# EAGLE schematic VLR_ENCoMAT (EAGLE 7.2.0)

## Sheet 1 of 2
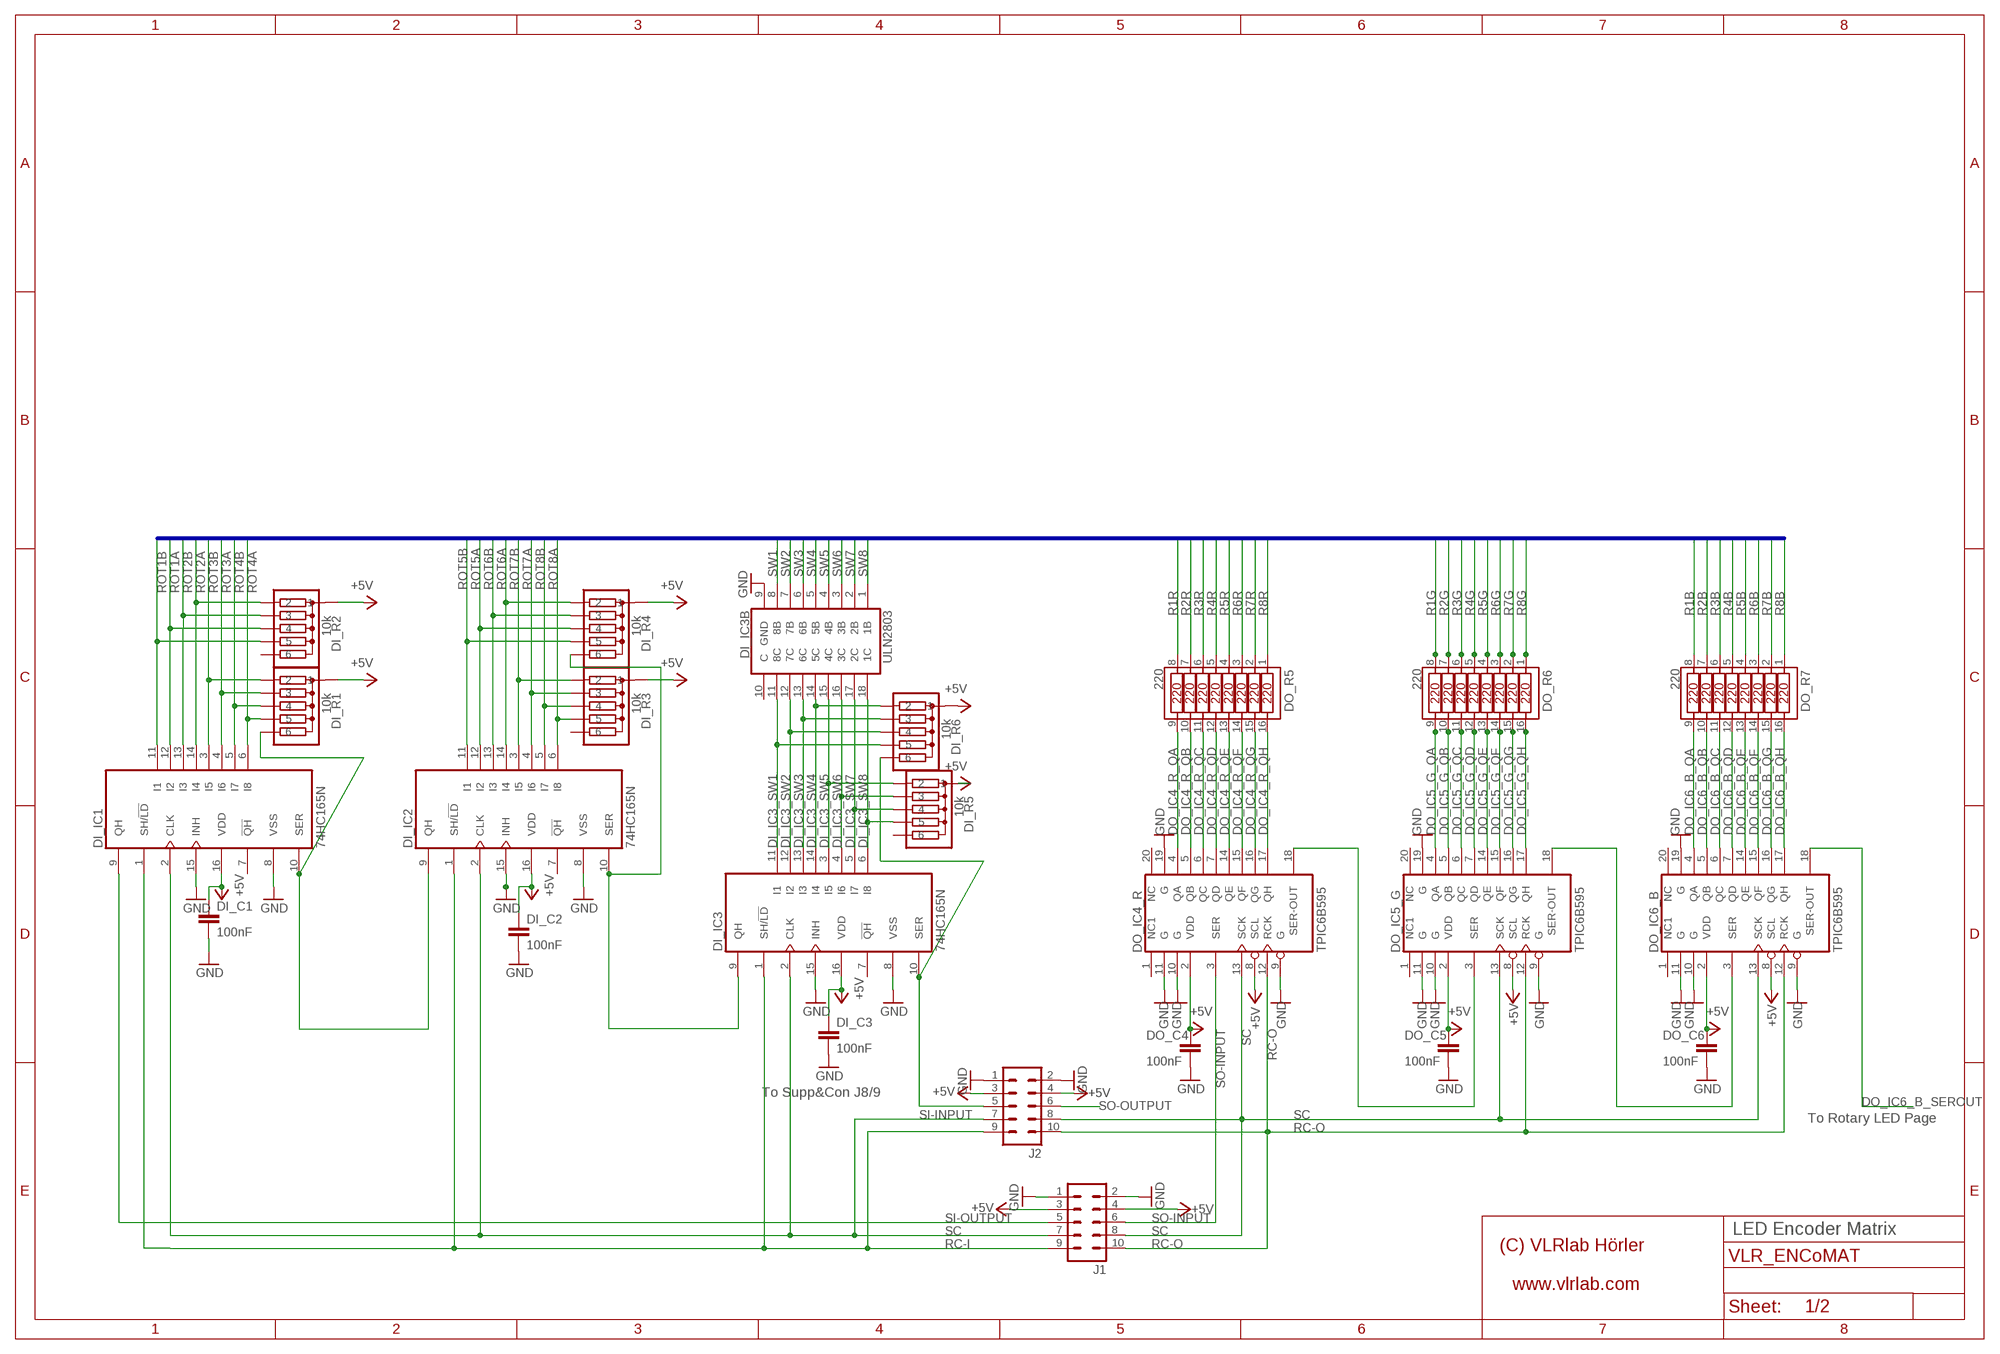
[diagram p0: schematic, sheet 1]

### Parts
DI_C1  100nF  C-EU025-024X044  [C025-024X044]
DI_C2  100nF  C-EU025-024X044  [C025-024X044]
DI_C3  100nF  C-EU025-024X044  [C025-024X044]
DI_IC1  74HC165N  74HC165NSO16D  [SO16D]
DI_IC2  74HC165N  74HC165NSO16D  [SO16D]
DI_IC3  74HC165N  74HC165NSO16D  [SO16D]
DI_IC3B  ULN2803  ULN2803SO18W  [SO18W]
DI_R1  10k  4306R-SMD-R  [SIL6-SMD-R]
DI_R2  10k  4306R-SMD  [SIL6-SMD]
DI_R3  10k  4306R-SMD-R  [SIL6-SMD-R]
DI_R4  10k  4306R-SMD  [SIL6-SMD]
DI_R5  10k  4306R-SMD  [SIL6-SMD]
DI_R6  10k  4306R-SMD-R  [SIL6-SMD-R]
DO_C4  100nF  C-EU025-024X044  [C025-024X044]
DO_C5  100nF  C-EU025-024X044  [C025-024X044]
DO_C6  100nF  C-EU025-024X044  [C025-024X044]
DO_IC4_R  TPIC6B595  TPIC6B595SO20W  [SO20W]
DO_IC5_G  TPIC6B595  TPIC6B595SO20W  [SO20W]
DO_IC6_B  TPIC6B595  TPIC6B595SO20W  [SO20W]
DO_R5  220  4816P-1SOIC16W  [SOIC16W]
DO_R6  220  4816P-1SOIC16W  [SOIC16W]
DO_R7  220  4816P-1SOIC16W  [SOIC16W]
J1  ML10  [ML10]
J2  ML10  [ML10]

### Nets
+5V [VDD]: DI_C1.1 DI_C2.1 DI_C3.1 DI_IC1.16(VDD) DI_IC2.16(VDD) DI_IC3.16(VDD) DI_R1.P$6 DI_R2.P$1 DI_R3.P$6 DI_R4.P$1 DI_R5.P$1 DI_R6.P$6 DO_C4.1 DO_C5.1 DO_C6.1 DO_IC4_R.2(VDD) DO_IC4_R.8(SCL) DO_IC5_G.2(VDD) DO_IC5_G.8(SCL) DO_IC6_B.2(VDD) DO_IC6_B.8(SCL) J1.3 J1.4 J2.3 J2.4 ; also sheet 2
DI_IC3_SW1: DI_IC3.11(I1) DI_IC3B.11(8C) DI_R6.P$2
DI_IC3_SW2: DI_IC3.12(I2) DI_IC3B.12(7C) DI_R6.P$3
DI_IC3_SW3: DI_IC3.13(I3) DI_IC3B.13(6C) DI_R6.P$4
DI_IC3_SW4: DI_IC3.14(I4) DI_IC3B.14(5C) DI_R6.P$5
DI_IC3_SW5: DI_IC3.3(I5) DI_IC3B.15(4C) DI_R5.P$2
DI_IC3_SW6: DI_IC3.4(I6) DI_IC3B.16(3C) DI_R5.P$3
DI_IC3_SW7: DI_IC3.5(I7) DI_IC3B.17(2C) DI_R5.P$4
DI_IC3_SW8: DI_IC3.6(I8) DI_IC3B.18(1C) DI_R5.P$5
DI_IC4_SER_OUT2: DI_IC1.10(SER) DI_IC2.9(QH) DI_R1.P$1
DI_IC5_SER_OUT2: DI_IC2.10(SER) DI_IC3.9(QH) DI_R4.P$6
DO_IC4_R_QA: DO_IC4_R.4(QA) DO_R5.9
DO_IC4_R_QB: DO_IC4_R.5(QB) DO_R5.10
DO_IC4_R_QC: DO_IC4_R.6(QC) DO_R5.11
DO_IC4_R_QD: DO_IC4_R.7(QD) DO_R5.12
DO_IC4_R_QE: DO_IC4_R.14(QE) DO_R5.13
DO_IC4_R_QF: DO_IC4_R.15(QF) DO_R5.14
DO_IC4_R_QG: DO_IC4_R.16(QG) DO_R5.15
DO_IC4_R_QH: DO_IC4_R.17(QH) DO_R5.16
DO_IC4_R_SEROUT: DO_IC4_R.18(SER-OUT) DO_IC5_G.3(SER)
DO_IC5_G_QA: DO_IC5_G.4(QA) DO_R6.9
DO_IC5_G_QB: DO_IC5_G.5(QB) DO_R6.10
DO_IC5_G_QC: DO_IC5_G.6(QC) DO_R6.11
DO_IC5_G_QD: DO_IC5_G.7(QD) DO_R6.12
DO_IC5_G_QE: DO_IC5_G.14(QE) DO_R6.13
DO_IC5_G_QF: DO_IC5_G.15(QF) DO_R6.14
DO_IC5_G_QG: DO_IC5_G.16(QG) DO_R6.15
DO_IC5_G_QH: DO_IC5_G.17(QH) DO_R6.16
DO_IC5_G_SEROUT: DO_IC5_G.18(SER-OUT) DO_IC6_B.3(SER)
DO_IC6_B_QA: DO_IC6_B.4(QA) DO_R7.9
DO_IC6_B_QB: DO_IC6_B.5(QB) DO_R7.10
DO_IC6_B_QC: DO_IC6_B.6(QC) DO_R7.11
DO_IC6_B_QD: DO_IC6_B.7(QD) DO_R7.12
DO_IC6_B_QE: DO_IC6_B.14(QE) DO_R7.13
DO_IC6_B_QF: DO_IC6_B.15(QF) DO_R7.14
DO_IC6_B_QG: DO_IC6_B.16(QG) DO_R7.15
DO_IC6_B_QH: DO_IC6_B.17(QH) DO_R7.16
DO_IC6_B_SEROUT: DO_IC6_B.18(SER-OUT) ; also sheet 2
GND: DI_C1.2 DI_C2.2 DI_C3.2 DI_IC1.8(VSS) DI_IC1.15(INH) DI_IC2.8(VSS) DI_IC2.15(INH) DI_IC3.8(VSS) DI_IC3.15(INH) DI_IC3B.9(GND) DO_C4.2 DO_C5.2 DO_C6.2 DO_IC4_R.9(G) DO_IC4_R.10(G) DO_IC4_R.11(G) DO_IC4_R.19(G) DO_IC5_G.9(G) DO_IC5_G.10(G) DO_IC5_G.11(G) DO_IC5_G.19(G) DO_IC6_B.9(G) DO_IC6_B.10(G) DO_IC6_B.11(G) DO_IC6_B.19(G) J1.1 J1.2 J2.1 J2.2 ; also sheet 2
R1B: DO_R7.8 ; also sheet 2
R1G: DO_R6.8 ; also sheet 2
R1R: DO_R5.8 ; also sheet 2
R2B: DO_R7.7 ; also sheet 2
R2G: DO_R6.7 ; also sheet 2
R2R: DO_R5.7 ; also sheet 2
R3B: DO_R7.6 ; also sheet 2
R3G: DO_R6.6 ; also sheet 2
R3R: DO_R5.6 ; also sheet 2
R4B: DO_R7.5 ; also sheet 2
R4G: DO_R6.5 ; also sheet 2
R4R: DO_R5.5 ; also sheet 2
R5B: DO_R7.4 ; also sheet 2
R5G: DO_R6.4 ; also sheet 2
R5R: DO_R5.4 ; also sheet 2
R6B: DO_R7.3 ; also sheet 2
R6G: DO_R6.3 ; also sheet 2
R6R: DO_R5.3 ; also sheet 2
R7B: DO_R7.2 ; also sheet 2
R7G: DO_R6.2 ; also sheet 2
R7R: DO_R5.2 ; also sheet 2
R8B: DO_R7.1 ; also sheet 2
R8G: DO_R6.1 ; also sheet 2
R8R: DO_R5.1 ; also sheet 2
RC-I: DI_IC1.1(SH/!LD) DI_IC2.1(SH/!LD) DI_IC3.1(SH/!LD) J1.9 J2.9
RC-O: DO_IC4_R.12(RCK) DO_IC5_G.12(RCK) DO_IC6_B.12(RCK) J1.10 J2.10 ; also sheet 2
ROT1A: DI_IC1.12(I2) DI_R2.P$4 ; also sheet 2
ROT1B: DI_IC1.11(I1) DI_R2.P$5 ; also sheet 2
ROT2A: DI_IC1.14(I4) DI_R2.P$2 ; also sheet 2
ROT2B: DI_IC1.13(I3) DI_R2.P$3 ; also sheet 2
ROT3A: DI_IC1.4(I6) DI_R1.P$4 ; also sheet 2
ROT3B: DI_IC1.3(I5) DI_R1.P$5 ; also sheet 2
ROT4A: DI_IC1.6(I8) DI_R1.P$2 ; also sheet 2
ROT4B: DI_IC1.5(I7) DI_R1.P$3 ; also sheet 2
ROT5A: DI_IC2.12(I2) DI_R4.P$4 ; also sheet 2
ROT5B: DI_IC2.11(I1) DI_R4.P$5 ; also sheet 2
ROT6A: DI_IC2.14(I4) DI_R4.P$2 ; also sheet 2
ROT6B: DI_IC2.13(I3) DI_R4.P$3 ; also sheet 2
ROT7A: DI_IC2.4(I6) DI_R3.P$4 ; also sheet 2
ROT7B: DI_IC2.3(I5) DI_R3.P$5 ; also sheet 2
ROT8A: DI_IC2.6(I8) DI_R3.P$2 ; also sheet 2
ROT8B: DI_IC2.5(I7) DI_R3.P$3 ; also sheet 2
SC: DI_IC1.2(CLK) DI_IC2.2(CLK) DI_IC3.2(CLK) DO_IC4_R.13(SCK) DO_IC5_G.13(SCK) DO_IC6_B.13(SCK) J1.7 J1.8 J2.7 J2.8 ; also sheet 2
SI-INPUT: DI_IC3.10(SER) DI_R6.P$1 J2.5
SI-OUTPUT: DI_IC1.9(QH) J1.5
SO-INPUT: DO_IC4_R.3(SER) J1.6
SO-OUTPUT: J2.6 ; also sheet 2
SW1: DI_IC3B.8(8B) ; also sheet 2
SW2: DI_IC3B.7(7B) ; also sheet 2
SW3: DI_IC3B.6(6B) ; also sheet 2
SW4: DI_IC3B.5(5B) ; also sheet 2
SW5: DI_IC3B.4(4B) ; also sheet 2
SW6: DI_IC3B.3(3B) ; also sheet 2
SW7: DI_IC3B.2(2B) ; also sheet 2
SW8: DI_IC3B.1(1B) ; also sheet 2
Unconnected: DI_IC1.7(!QH) DI_IC2.7(!QH) DI_IC3.7(!QH) DI_IC3B.10(C) DI_R2.P$6 DI_R3.P$1 DI_R5.P$6 DO_IC4_R.1(NC1) DO_IC4_R.20(NC) DO_IC5_G.1(NC1) DO_IC5_G.20(NC) DO_IC6_B.1(NC1) DO_IC6_B.20(NC)

### Buses
SW1,SW2,SW3,SW4,SW5,SW6,SW7,SW8,R1B,R2B,R3B,R4B,R5B,R6B,R7B,R8B,R1G,R2G,R3G,R4G,R5G,R6G,R7G,R8G,R1R,R2R,R3R,R4R,R5R,R6R,R7R,R8R,ROT1B,ROT1A,ROT2B,ROT2A,ROT3B,ROT3A,ROT4B,ROT4A,ROT5B,ROT5A,ROT6B,ROT6A,ROT7B,ROT7A,ROT8B,ROT8A

### Notes on the sheet
- To Supp&Con J8/9
- To Rotary LED Page
- LED Encoder Matrix

## Sheet 2 of 2
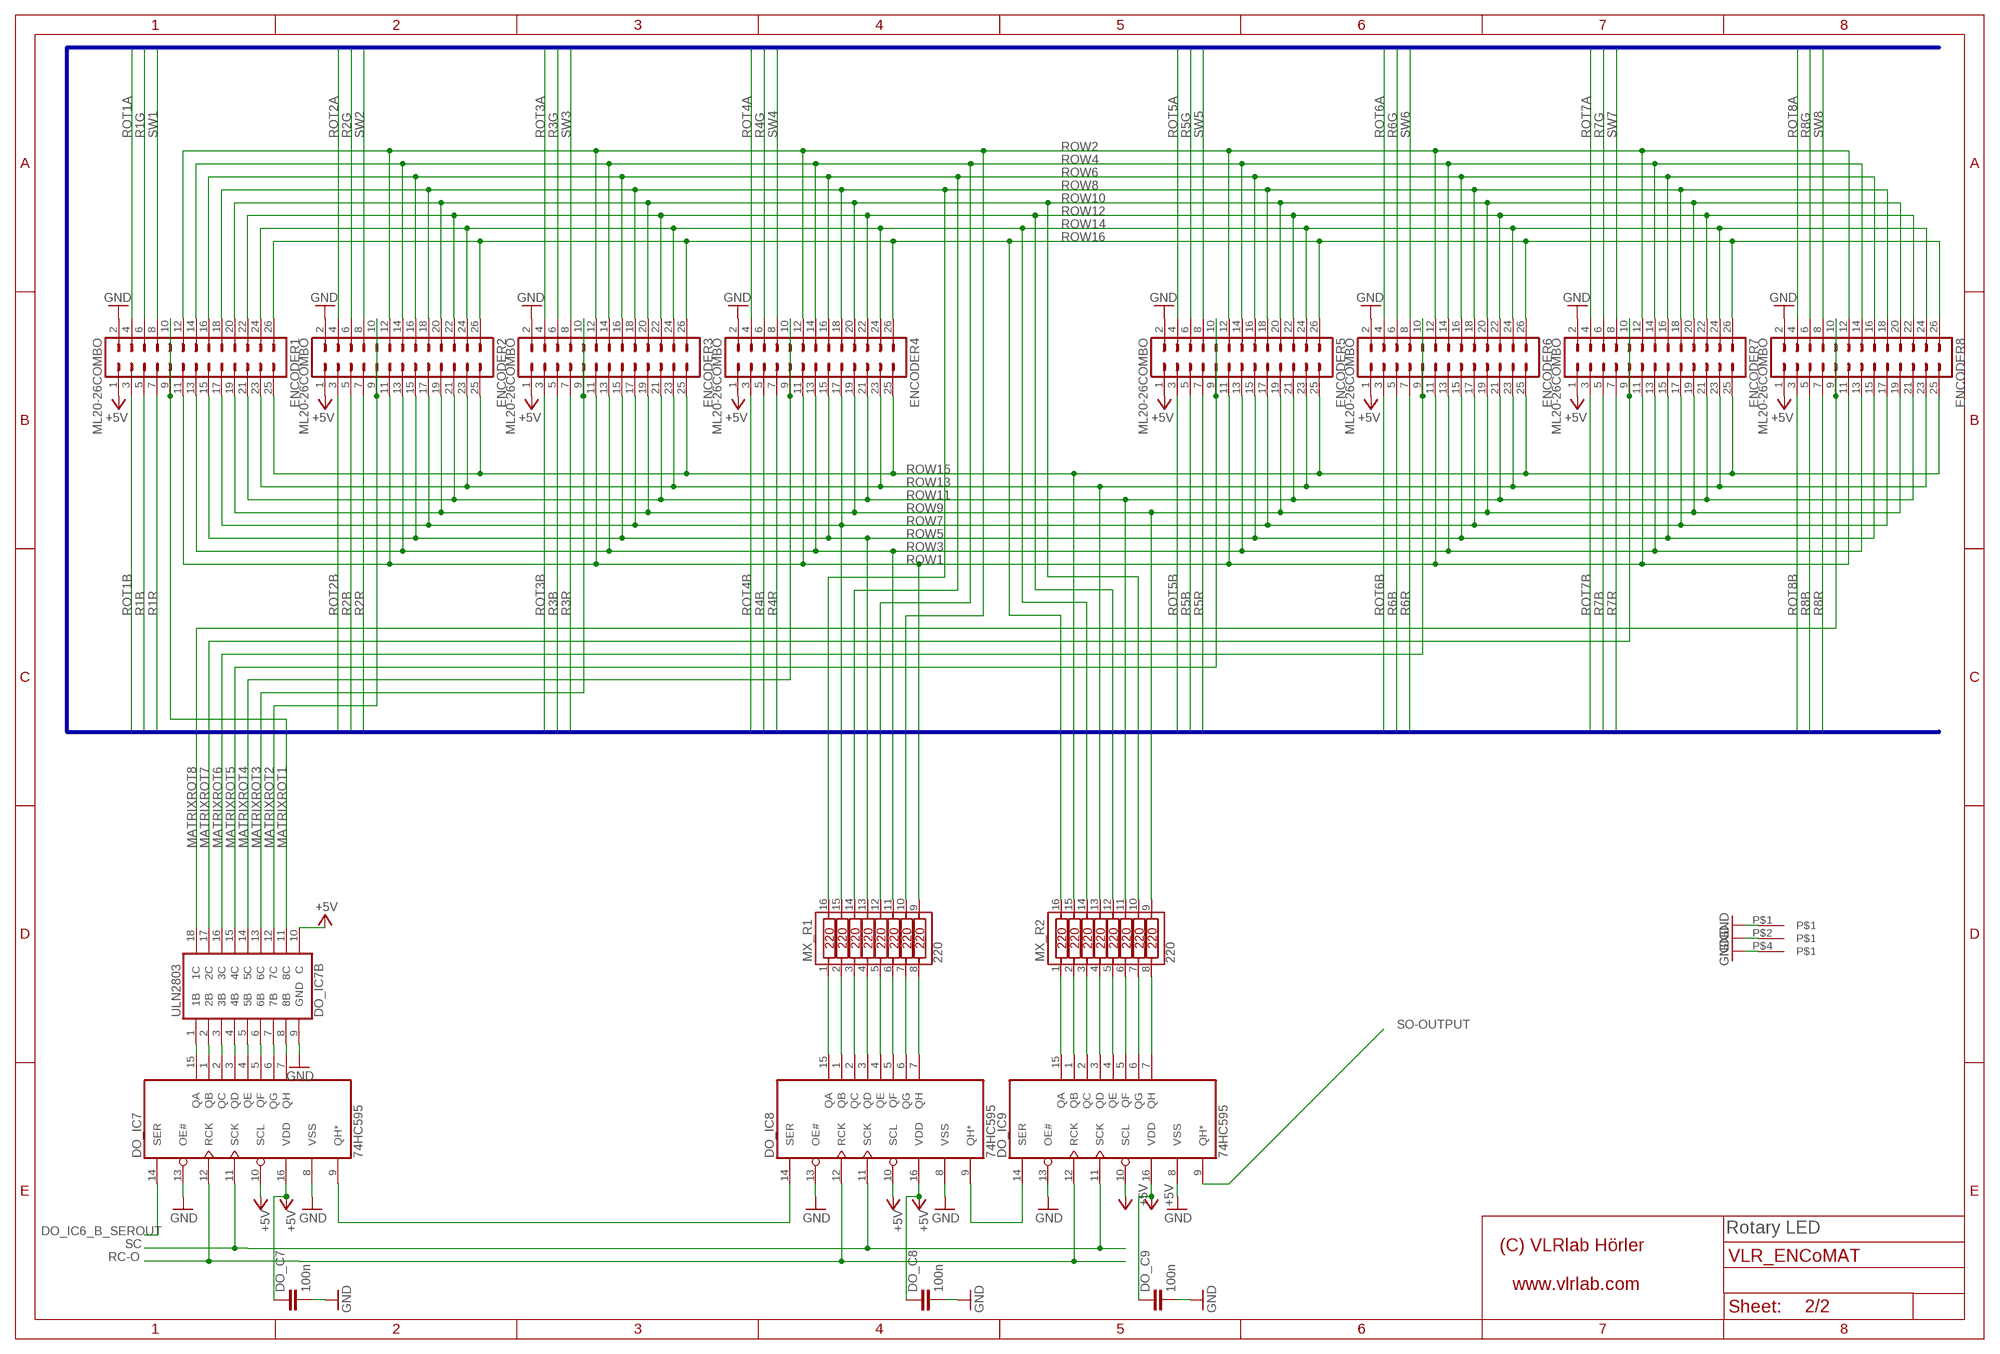
[diagram p1: schematic, sheet 2]

### Parts
DO_C7  100n  C-EU025-024X044  [C025-024X044]
DO_C8  100n  C-EU025-024X044  [C025-024X044]
DO_C9  100n  C-EU025-024X044  [C025-024X044]
DO_IC7  74HC595  74HC595SO16D  [SO16D]
DO_IC7B  ULN2803  ULN2803SO18W  [SO18W]
DO_IC8  74HC595  74HC595SO16D  [SO16D]
DO_IC9  74HC595  74HC595SO16D  [SO16D]
ENCODER1  ML20-26COMBO  [ML20-26COMBO]
ENCODER2  ML20-26COMBO  [ML20-26COMBO]
ENCODER3  ML20-26COMBO  [ML20-26COMBO]
ENCODER4  ML20-26COMBO  [ML20-26COMBO]
ENCODER5  ML20-26COMBO  [ML20-26COMBO]
ENCODER6  ML20-26COMBO  [ML20-26COMBO]
ENCODER7  ML20-26COMBO  [ML20-26COMBO]
ENCODER8  ML20-26COMBO  [ML20-26COMBO]
MX_R1  220  4816P-1SOIC16W  [SOIC16W]
MX_R2  220  4816P-1SOIC16W  [SOIC16W]
U$2  MIDIBOX_HALF  [MIDIBOX14X6]

### Nets
+5V [VDD]: DO_C7.1 DO_C8.1 DO_C9.1 DO_IC7.10(SCL) DO_IC7.16(VDD) DO_IC7B.10(C) DO_IC8.10(SCL) DO_IC8.16(VDD) DO_IC9.10(SCL) DO_IC9.16(VDD) ENCODER1.1 ENCODER2.1 ENCODER3.1 ENCODER4.1 ENCODER5.1 ENCODER6.1 ENCODER7.1 ENCODER8.1 ; also sheet 1
DO_IC6_B_SEROUT: DO_IC7.14(SER) ; also sheet 1
DO_IC7_QA: DO_IC7.15(QA) DO_IC7B.1(1B)
DO_IC7_QB: DO_IC7.1(QB) DO_IC7B.2(2B)
DO_IC7_QC: DO_IC7.2(QC) DO_IC7B.3(3B)
DO_IC7_QD: DO_IC7.3(QD) DO_IC7B.4(4B)
DO_IC7_QE: DO_IC7.4(QE) DO_IC7B.5(5B)
DO_IC7_QF: DO_IC7.5(QF) DO_IC7B.6(6B)
DO_IC7_QG: DO_IC7.6(QG) DO_IC7B.7(7B)
DO_IC7_QH: DO_IC7.7(QH) DO_IC7B.8(8B)
DO_IC7_SEROUT: DO_IC7.9(QH*) DO_IC8.14(SER)
DO_IC8_ROW1: DO_IC8.7(QH) MX_R1.8
DO_IC8_ROW2: DO_IC8.6(QG) MX_R1.7
DO_IC8_ROW3: DO_IC8.5(QF) MX_R1.6
DO_IC8_ROW4: DO_IC8.4(QE) MX_R1.5
DO_IC8_ROW5: DO_IC8.3(QD) MX_R1.4
DO_IC8_ROW6: DO_IC8.2(QC) MX_R1.3
DO_IC8_ROW7: DO_IC8.1(QB) MX_R1.2
DO_IC8_ROW8: DO_IC8.15(QA) MX_R1.1
DO_IC8_SEROUT: DO_IC8.9(QH*) DO_IC9.14(SER)
DO_IC9_ROW1: DO_IC9.7(QH) MX_R2.8
DO_IC9_ROW2: DO_IC9.6(QG) MX_R2.7
DO_IC9_ROW3: DO_IC9.5(QF) MX_R2.6
DO_IC9_ROW4: DO_IC9.4(QE) MX_R2.5
DO_IC9_ROW5: DO_IC9.3(QD) MX_R2.4
DO_IC9_ROW6: DO_IC9.2(QC) MX_R2.3
DO_IC9_ROW7: DO_IC9.1(QB) MX_R2.2
DO_IC9_ROW8: DO_IC9.15(QA) MX_R2.1
GND: DO_C7.2 DO_C8.2 DO_C9.2 DO_IC7.8(VSS) DO_IC7.13(OE#) DO_IC7B.9(GND) DO_IC8.8(VSS) DO_IC8.13(OE#) DO_IC9.8(VSS) DO_IC9.13(OE#) ENCODER1.2 ENCODER2.2 ENCODER3.2 ENCODER4.2 ENCODER5.2 ENCODER6.2 ENCODER7.2 ENCODER8.2 U$2.P$1 U$2.P$2 U$2.P$4 ; also sheet 1
MATRIXROT1: DO_IC7B.11(8C) ENCODER1.9 ENCODER1.10
MATRIXROT2: DO_IC7B.12(7C) ENCODER2.9 ENCODER2.10
MATRIXROT3: DO_IC7B.13(6C) ENCODER3.9 ENCODER3.10
MATRIXROT4: DO_IC7B.14(5C) ENCODER4.9 ENCODER4.10
MATRIXROT5: DO_IC7B.15(4C) ENCODER5.9 ENCODER5.10
MATRIXROT6: DO_IC7B.16(3C) ENCODER6.9 ENCODER6.10
MATRIXROT7: DO_IC7B.17(2C) ENCODER7.9 ENCODER7.10
MATRIXROT8: DO_IC7B.18(1C) ENCODER8.9 ENCODER8.10
R1B: ENCODER1.5 ; also sheet 1
R1G: ENCODER1.6 ; also sheet 1
R1R: ENCODER1.7 ; also sheet 1
R2B: ENCODER2.5 ; also sheet 1
R2G: ENCODER2.6 ; also sheet 1
R2R: ENCODER2.7 ; also sheet 1
R3B: ENCODER3.5 ; also sheet 1
R3G: ENCODER3.6 ; also sheet 1
R3R: ENCODER3.7 ; also sheet 1
R4B: ENCODER4.5 ; also sheet 1
R4G: ENCODER4.6 ; also sheet 1
R4R: ENCODER4.7 ; also sheet 1
R5B: ENCODER5.5 ; also sheet 1
R5G: ENCODER5.6 ; also sheet 1
R5R: ENCODER5.7 ; also sheet 1
R6B: ENCODER6.5 ; also sheet 1
R6G: ENCODER6.6 ; also sheet 1
R6R: ENCODER6.7 ; also sheet 1
R7B: ENCODER7.5 ; also sheet 1
R7G: ENCODER7.6 ; also sheet 1
R7R: ENCODER7.7 ; also sheet 1
R8B: ENCODER8.5 ; also sheet 1
R8G: ENCODER8.6 ; also sheet 1
R8R: ENCODER8.7 ; also sheet 1
RC-O: DO_IC7.12(RCK) DO_IC8.12(RCK) DO_IC9.12(RCK) ; also sheet 1
ROT1A: ENCODER1.4 ; also sheet 1
ROT1B: ENCODER1.3 ; also sheet 1
ROT2A: ENCODER2.4 ; also sheet 1
ROT2B: ENCODER2.3 ; also sheet 1
ROT3A: ENCODER3.4 ; also sheet 1
ROT3B: ENCODER3.3 ; also sheet 1
ROT4A: ENCODER4.4 ; also sheet 1
ROT4B: ENCODER4.3 ; also sheet 1
ROT5A: ENCODER5.4 ; also sheet 1
ROT5B: ENCODER5.3 ; also sheet 1
ROT6A: ENCODER6.4 ; also sheet 1
ROT6B: ENCODER6.3 ; also sheet 1
ROT7A: ENCODER7.4 ; also sheet 1
ROT7B: ENCODER7.3 ; also sheet 1
ROT8A: ENCODER8.4 ; also sheet 1
ROT8B: ENCODER8.3 ; also sheet 1
ROW1: ENCODER1.11 ENCODER2.11 ENCODER3.11 ENCODER4.11 ENCODER5.11 ENCODER6.11 ENCODER7.11 ENCODER8.11 MX_R1.9
ROW2: ENCODER1.12 ENCODER2.12 ENCODER3.12 ENCODER4.12 ENCODER5.12 ENCODER6.12 ENCODER7.12 ENCODER8.12 MX_R1.10
ROW3: ENCODER1.13 ENCODER2.13 ENCODER3.13 ENCODER4.13 ENCODER5.13 ENCODER6.13 ENCODER7.13 ENCODER8.13 MX_R1.11
ROW4: ENCODER1.14 ENCODER2.14 ENCODER3.14 ENCODER4.14 ENCODER5.14 ENCODER6.14 ENCODER7.14 ENCODER8.14 MX_R1.12
ROW5: ENCODER1.15 ENCODER2.15 ENCODER3.15 ENCODER4.15 ENCODER5.15 ENCODER6.15 ENCODER7.15 ENCODER8.15 MX_R1.13
ROW6: ENCODER1.16 ENCODER2.16 ENCODER3.16 ENCODER4.16 ENCODER5.16 ENCODER6.16 ENCODER7.16 ENCODER8.16 MX_R1.14
ROW7: ENCODER1.17 ENCODER2.17 ENCODER3.17 ENCODER4.17 ENCODER5.17 ENCODER6.17 ENCODER7.17 ENCODER8.17 MX_R1.15
ROW8: ENCODER1.18 ENCODER2.18 ENCODER3.18 ENCODER4.18 ENCODER5.18 ENCODER6.18 ENCODER7.18 ENCODER8.18 MX_R1.16
ROW9: ENCODER1.19 ENCODER2.19 ENCODER3.19 ENCODER4.19 ENCODER5.19 ENCODER6.19 ENCODER7.19 ENCODER8.19 MX_R2.9
ROW10: ENCODER1.20 ENCODER2.20 ENCODER3.20 ENCODER4.20 ENCODER5.20 ENCODER6.20 ENCODER7.20 ENCODER8.20 MX_R2.10
ROW11: ENCODER1.21 ENCODER2.21 ENCODER3.21 ENCODER4.21 ENCODER5.21 ENCODER6.21 ENCODER7.21 ENCODER8.21 MX_R2.11
ROW12: ENCODER1.22 ENCODER2.22 ENCODER3.22 ENCODER4.22 ENCODER5.22 ENCODER6.22 ENCODER7.22 ENCODER8.22 MX_R2.12
ROW13: ENCODER1.23 ENCODER2.23 ENCODER3.23 ENCODER4.23 ENCODER5.23 ENCODER6.23 ENCODER7.23 ENCODER8.23 MX_R2.13
ROW14: ENCODER1.24 ENCODER2.24 ENCODER3.24 ENCODER4.24 ENCODER5.24 ENCODER6.24 ENCODER7.24 ENCODER8.24 MX_R2.14
ROW15: ENCODER1.25 ENCODER2.25 ENCODER3.25 ENCODER4.25 ENCODER5.25 ENCODER6.25 ENCODER7.25 ENCODER8.25 MX_R2.15
ROW16: ENCODER1.26 ENCODER2.26 ENCODER3.26 ENCODER4.26 ENCODER5.26 ENCODER6.26 ENCODER7.26 ENCODER8.26 MX_R2.16
SC: DO_IC7.11(SCK) DO_IC8.11(SCK) DO_IC9.11(SCK) ; also sheet 1
SO-OUTPUT: DO_IC9.9(QH*) ; also sheet 1
SW1: ENCODER1.8 ; also sheet 1
SW2: ENCODER2.8 ; also sheet 1
SW3: ENCODER3.8 ; also sheet 1
SW4: ENCODER4.8 ; also sheet 1
SW5: ENCODER5.8 ; also sheet 1
SW6: ENCODER6.8 ; also sheet 1
SW7: ENCODER7.8 ; also sheet 1
SW8: ENCODER8.8 ; also sheet 1

### Buses
SW1,SW2,SW3,SW4,SW5,SW6,SW7,SW8,R1B,R2B,R3B,R4B,R5B,R6B,R7B,R8B,R1G,R2G,R3G,R4G,R5G,R6G,R7G,R8G,R1R,R2R,R3R,R4R,R5R,R6R,R7R,R8R,ROT1B,ROT1A,ROT2B,ROT2A,ROT3B,ROT3A,ROT4B,ROT4A,ROT5B,ROT5A,ROT6B,ROT6A,ROT7B,ROT7A,ROT8B,ROT8A

### Notes on the sheet
- Rotary LED

## Library data of the parts
DI_C1-DI_C3 DO_C4-DO_C9 = rcl:C-EU: CAPACITOR, European symbol
DI_IC1-DI_IC3 = 595-541-165-uln2803:74HC165N
DI_IC3B DO_IC7B = 595-541-165-uln2803:ULN2803
DI_R1 DI_R3 DI_R6 = Bourns Resistor Array:4306R-SMD-R
DI_R2 DI_R4 DI_R5 = Bourns Resistor Array:4306R-SMD
DO_IC4_R DO_IC5_G DO_IC6_B = TPIC6B595:TPIC6B595
DO_IC7-DO_IC9 = 595-541-165-uln2803:74HC595
DO_R5-DO_R7 MX_R1 MX_R2 = Bourns Resistor Array:4816P-1
ENCODER1-ENCODER8 = con-ml_Ivan:ML20-26COMBO
J1 J2 = con-ml:ML10: HARTING; OC_FARNELL: unknown; OC_NEWARK: unknown
U$2 = Frames_VLR:MIDIBOX_HALF

## Net classes
0 default: width 0.254 mm, drill 0.33 mm, clearance 0.254 mm
1 VDD: width 0.406 mm, drill 0.33 mm, clearance 0.254 mm to class 0, clearance 0.254 mm